# Altium schematic sheet MCU_SCHEM_REV1.SchDoc
size A3; SheetNumber: 1; SheetTotal: 1
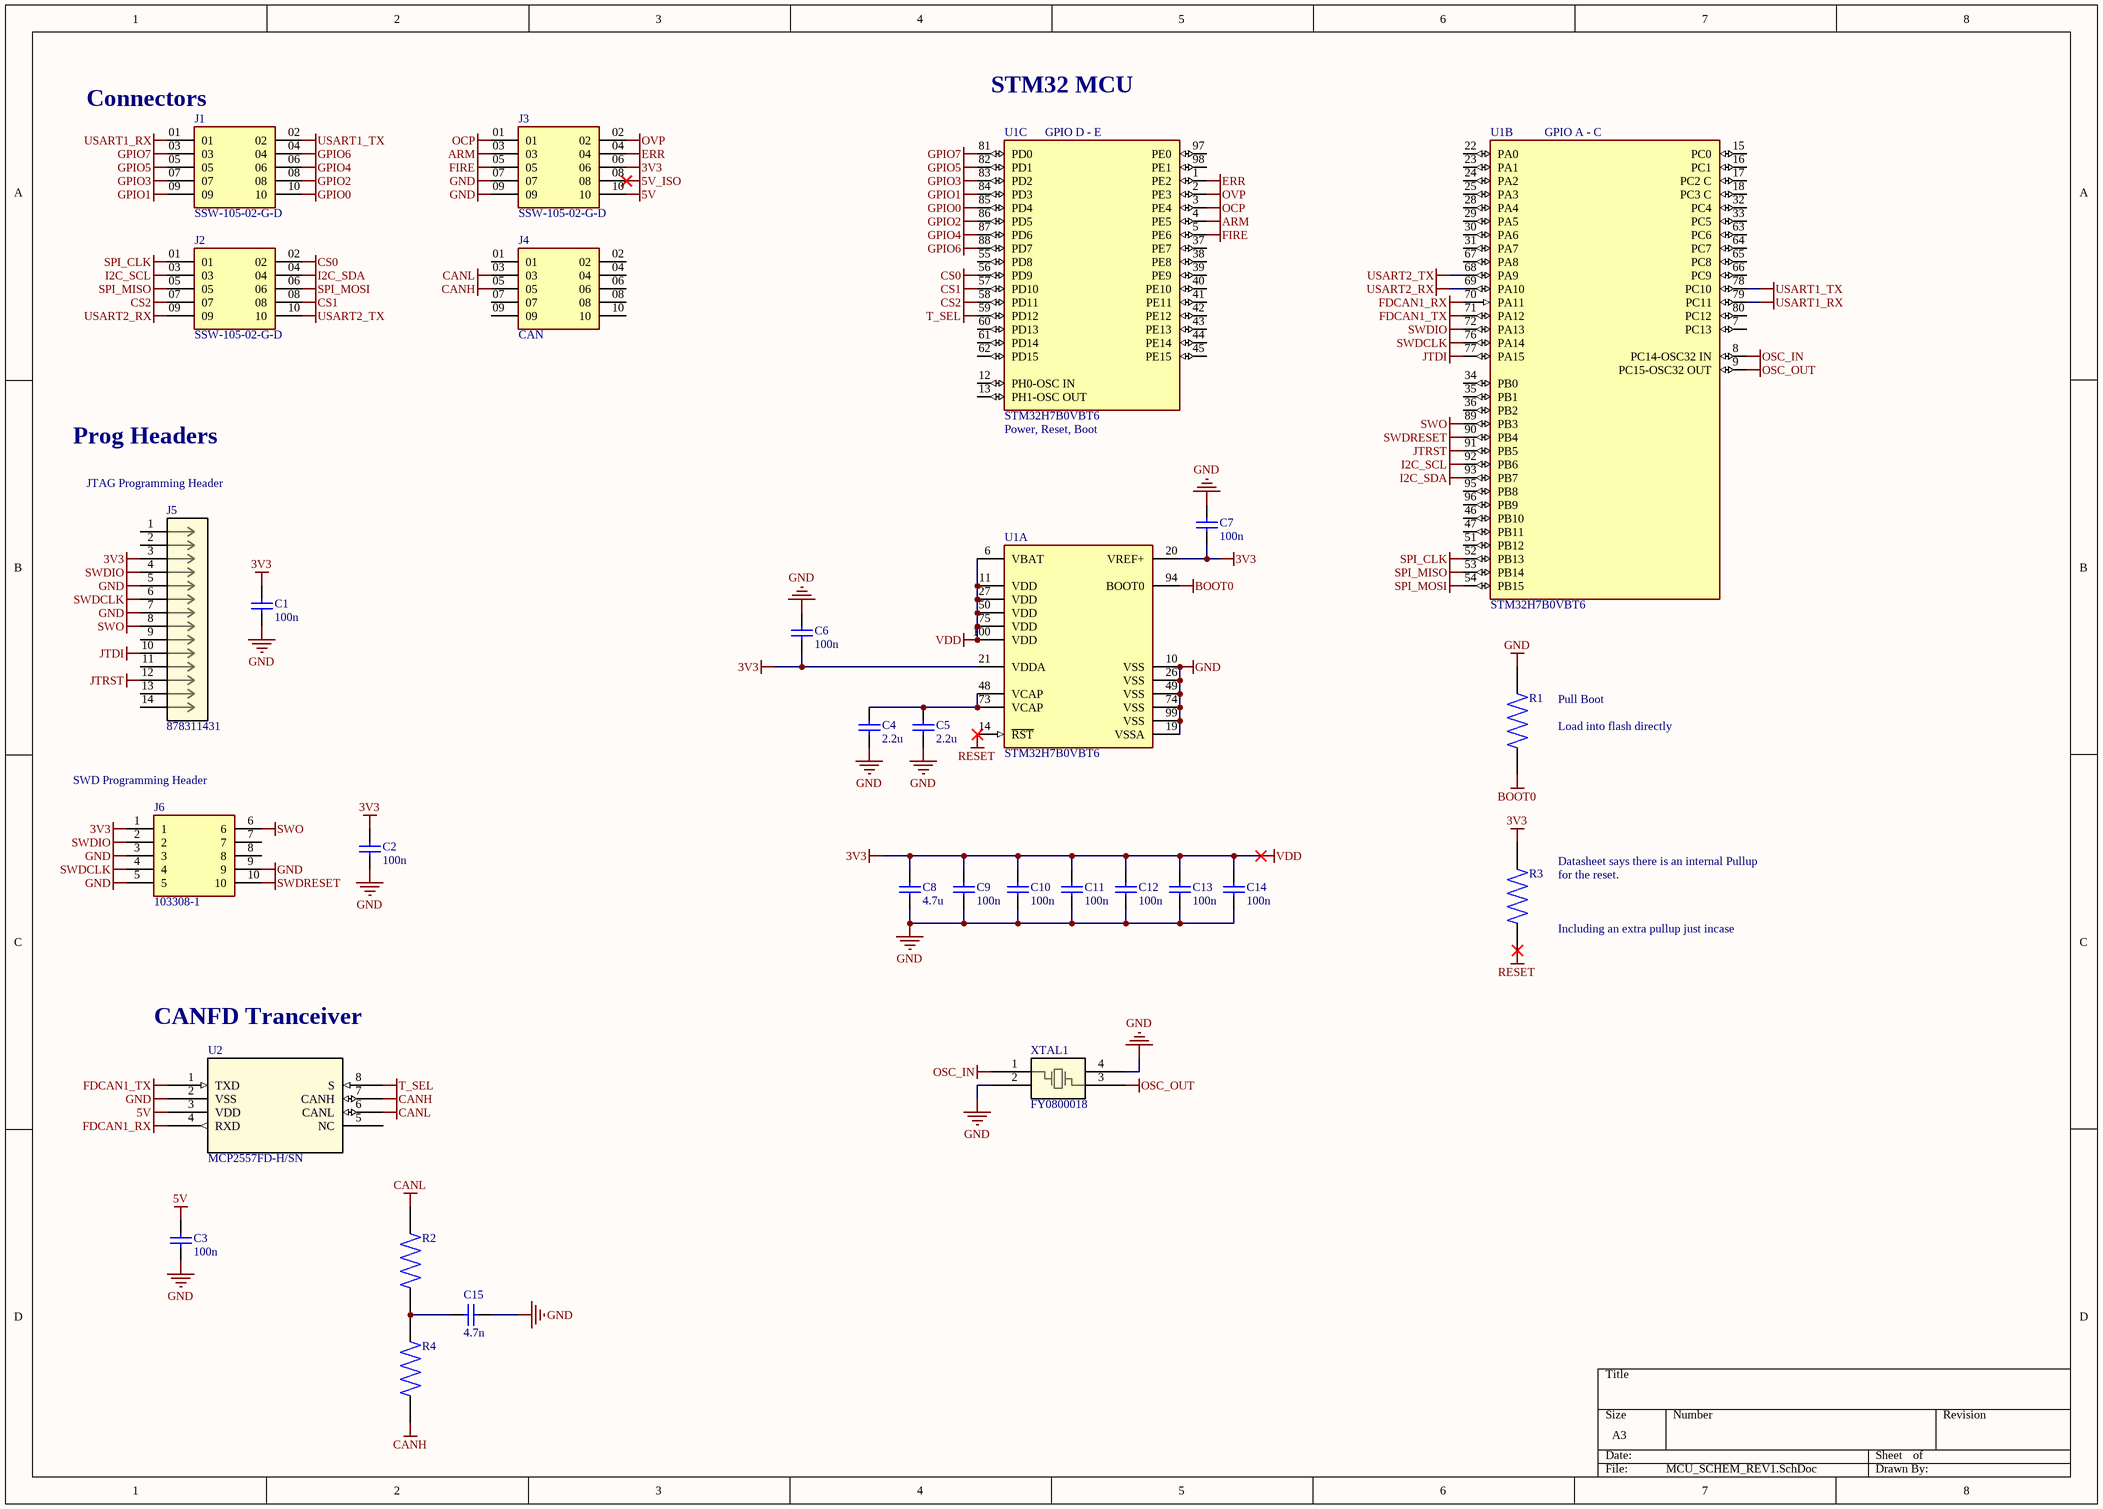
[diagram p0: MCU_SCHEM_REV1.SchDoc]

## Parts
C1  100n  [CAPC2013X145X48NL20T23]
C2  100n  [CAPC2013X145X48NL20T23]
C3  100n  [CAPC2013X145X48NL20T23]
C4  2.2u  [CAPC2013X145X48NL20T23]
C5  2.2u  [CAPC2013X145X48NL20T23]
C6  100n  [CAPC2013X145X48NL20T23]
C7  100n  [CAPC2013X145X48NL20T23]
C8  4.7u  [CAPC2013X145X48NL20T23]
C9  100n  [CAPC2013X145X48NL20T23]
C10  100n  [CAPC2013X145X48NL20T23]
C11  100n  [CAPC2013X145X48NL20T23]
C12  100n  [CAPC2013X145X48NL20T23]
C13  100n  [CAPC2013X145X48NL20T23]
C14  100n  [CAPC2013X145X48NL20T23]
C15  4.7n  [CAPC2013X145X48NL20T23]
J1  SSW-105-02-G-D  [SAMTEC_SSW-105-02-G-D]
J2  SSW-105-02-G-D  [SAMTEC_SSW-105-02-G-D]
J3  SSW-105-02-G-D  [SAMTEC_SSW-105-02-G-D]
J4  CAN  [SAMTEC_SSW-105-02-G-D]
J5  878311431  [CONN14_878311431_MOL]
J6  103308-1  [TE_103308-1]
R1  (no value)  [RESC2012X65N]
R2  (no value)  [RESC2012X65N]
R3  (no value)  [RESC2012X65N]
R4  (no value)  [RESC2012X65N]
U1  STM32H7B0VBT6  [FP-LQFP100-MFG]  (parts A,B,C of 3)
U2  MCP2557FD-H/SN  [SOIC8_SN_MCH]
XTAL1  FY0800018  [4xtal- 1-3xtal 2-4NC_DIO]

## Nets
3V3: C1.2 C2.2 C6.1 C7.1 C8.2 C9.2 C10.2 C11.2 C12.2 C13.2 C14.2 J3.06 J5.3 J6.1 R3.2 U1.6(VBAT) U1.11(VDD) U1.20(VREF+) U1.21(VDDA) U1.27(VDD) U1.50(VDD) U1.75(VDD) U1.100(VDD)  [also labelled VDD]
5V: C3.2 J3.10 U2.3(VDD)
5V_ISO: J3.08
ARM: J3.03 U1.4(PE5)
BOOT0: R1.1 U1.94(BOOT0)
CANH: J4.05 R4.1 U2.7(CANH)
CANL: J4.03 R2.2 U2.6(CANL)
CS0: J2.02 U1.56(PD9)
CS1: J2.08 U1.57(PD10)
CS2: J2.07 U1.58(PD11)
ERR: J3.04 U1.1(PE2)
FDCAN1_RX: U1.70(PA11) U2.4(RXD)
FDCAN1_TX: U1.71(PA12) U2.1(TXD)
FIRE: J3.05 U1.5(PE6)
GND: C1.1 C2.1 C3.1 C4.1 C5.1 C6.2 C7.2 C8.1 C9.1 C10.1 C11.1 C12.1 C13.1 C14.1 C15.1 J3.07 J3.09 J5.5 J5.7 J6.3 J6.5 J6.9 R1.2 U1.10(VSS) U1.19(VSSA) U1.26(VSS) U1.49(VSS) U1.74(VSS) U1.99(VSS) U2.2(VSS) XTAL1.2 XTAL1.4
GPIO0: J1.10 U1.85(PD4)
GPIO1: J1.09 U1.84(PD3)
GPIO2: J1.08 U1.86(PD5)
GPIO3: J1.07 U1.83(PD2)
GPIO4: J1.06 U1.87(PD6)
GPIO5: J1.05 U1.82(PD1)
GPIO6: J1.04 U1.88(PD7)
GPIO7: J1.03 U1.81(PD0)
I2C_SCL: J2.03 U1.92(PB6)
I2C_SDA: J2.04 U1.93(PB7)
JTDI: J5.10 U1.77(PA15)
JTRST: J5.12 U1.91(PB5)
OCP: J3.01 U1.3(PE4)
OSC_IN: U1.8(PC14-OSC32_IN) XTAL1.1
OSC_OUT: U1.9(PC15-OSC32_OUT) XTAL1.3
OVP: J3.02 U1.2(PE3)
RESET: R3.1 U1.14(~{RST})
SPI_CLK: J2.01 U1.52(PB13)
SPI_MISO: J2.05 U1.53(PB14)
SPI_MOSI: J2.06 U1.54(PB15)
SWDCLK: J5.6 J6.4 U1.76(PA14)
SWDIO: J5.4 J6.2 U1.72(PA13)
SWDRESET: J6.10 U1.90(PB4)
SWO: J5.8 J6.6 U1.89(PB3)
T_SEL: U1.59(PD12) U2.8(S)
USART1_RX: J1.01 U1.79(PC11)
USART1_TX: J1.02 U1.78(PC10)
USART2_RX: J2.09 U1.69(PA10)
USART2_TX: J2.10 U1.68(PA9)
NetC4_2: C4.2 C5.2 U1.48(VCAP) U1.73(VCAP)
NetC15_2: C15.2 R2.1 R4.2

Not connected (* = marked no-connect by the designer): J4 01 02 04 06 07 08 09 10; J5 1 2 9 11 13 14; J6 7 8; U1 7(PC13) 12(PH0-OSC_IN) 13(PH1-OSC_OUT) 15(PC0) 16(PC1) 17(PC2_C) 18(PC3_C) 22(PA0) 23(PA1) 24(PA2) 25(PA3) 28(PA4) 29(PA5) 30(PA6) 31(PA7) 32(PC4) 33(PC5) 34(PB0) 35(PB1) 36(PB2) 37(PE7) 38(PE8) 39(PE9) 40(PE10) 41(PE11) 42(PE12) 43(PE13) 44(PE14) 45(PE15) 46(PB10) 47(PB11) 51(PB12) 55(PD8) 60(PD13) 61(PD14) 62(PD15) 63(PC6) 64(PC7) 65(PC8) 66(PC9) 67(PA8) 80(PC12) 95(PB8) 96(PB9) 97(PE0) 98(PE1); U2 5(NC)

## Notes on the sheet
- (near J1) Connectors
- STM32 MCU
- (near U1) GPIO D - E
- (near U1) GPIO A - C
- Prog Headers
- (near U1) Power, Reset, Boot
- (near J5) JTAG Programming Header
- (near R1) Pull Boot
- (near J6) SWD Programming Header
- (near R1) Load into flash directly
- (near R3) Datasheet says there is an internal Pullup
- (near R3) for the reset.
- (near R3) Including an extra pullup just incase
- CANFD Tranceiver

## Library data of the parts
C1-C15 = CMP-2007-03205-1: 100u; Manufacturer: Vitramon; Part Number: VJ0805Y682KXAMT
J1-J4 = SSW-105-02-G-D: MF: Samtec Inc.; Package: None; Availability: Unavailable; Value: *; MP: SSW-105-02-G-D; Price: None
J5 = 878311431: 2.00mm Pitch, Milli-Grid PCB Header, Dual Row, Vertical, Through Hole, Shrouded, 14 Circuits, 0.38Âµm Gold (Au) Plating, with Center Polarization Slot, with Locking Window, without PCB Locator, with Open End Wall, Tube; Manufacturer_Name: Molex Connector Corporation; Copyright: Copyright (C) 2026 Ultra Librarian. All rights reserved.; Manufacturer_Part_Number: 878311431; Datasheet: https://www.molex.com/en-us/products/part-detail-pdf/878311431?display=pdf; RefDes: RefDes; Type: Type
J6 = 103308-1: Header;  Pin;  Vertical;  Copper Alloy;  Thermoplastic;  10;  0.100 x 0.100 in.;  1 A; MF: TE Connectivity; Package: None; MP: 103308-1; Value: *; Price: None; Availability: Unavailable; SnapEDA_Link: https://www.snapeda.com/parts/103308-1/TE%20Connectivity%20AMP%20Connectors/view-part/519501/?ref=snap
R1-R4 = RN73C2A1K0BTD: RN 0805 1K0 0.1% 10PPM 5KRL; Package: None; Price: None; Value: *; MP: RN73C2A1K0BTD; Availability: Unavailable
U1 = CMP-12105-000109-1: IC MCU 32BIT 128KB FLASH 100LQFP
U2 = MCP2557FD-HSN: No Description Available; Manufacturer_Name: Microchip; Copyright: Copyright (C) 2026 Ultra Librarian. All rights reserved.; Manufacturer_Part_Number: MCP2557FD-H/SN; RefDes: RefDes; Type: Type
XTAL1 = FY0800018: Description; Manufacturer_Name: Diodes Inc; Copyright: Copyright (C) 2025 Ultra Librarian. All rights reserved.; Manufacturer_Part_Number: FY0800018; RefDes: RefDes; Type: Type